# Altium schematic sheet main_9.SchDoc
size 212 x 108 mm; CNAME: RJ Cunningham
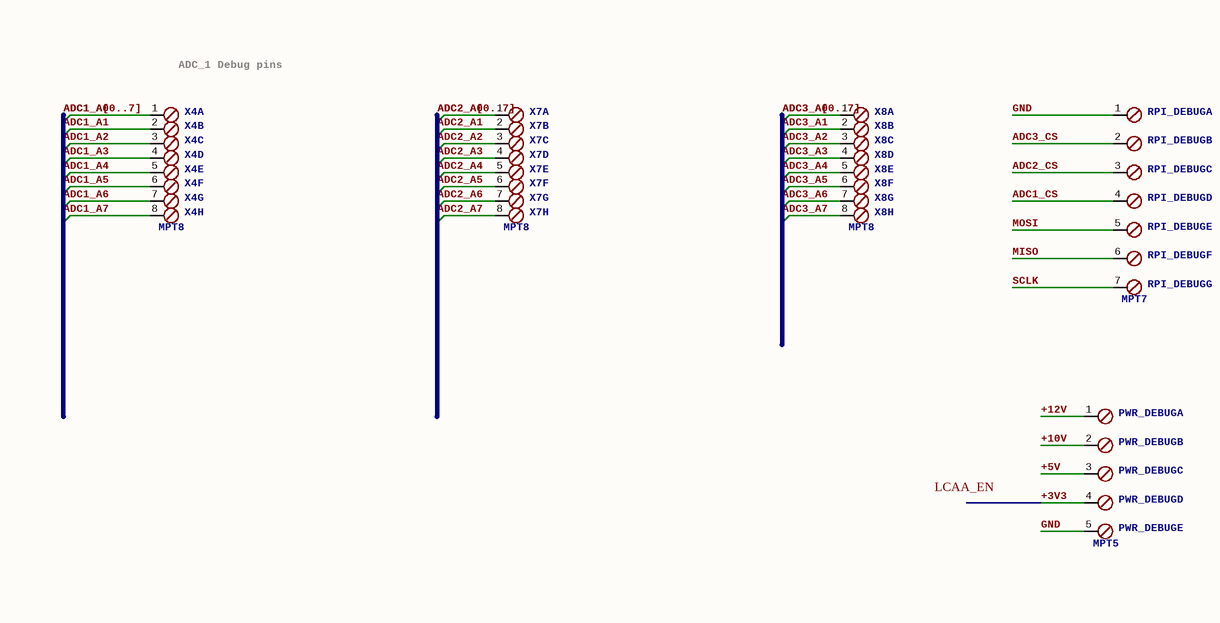
[diagram p0: main_9.SchDoc]

## Parts
PWR_DEBUG  MPT5  [5POL254]  (value not drawn)  (parts A,B,C,D,E of 5)
RPI_DEBUG  MPT7  [7POL254]  (value not drawn)  (parts A,B,C,D,E,F,G of 7)
X4  MPT8  [8POL254]  (value not drawn)  (parts A,B,C,D,E,F,G,H of 8)
X7  MPT8  [8POL254]  (value not drawn)  (parts A,B,C,D,E,F,G,H of 8)
X8  MPT8  [8POL254]  (value not drawn)  (parts A,B,C,D,E,F,G,H of 8)

## Nets
+3V3: PWR_DEBUG.4
+5V: PWR_DEBUG.3
+10V: PWR_DEBUG.2
+12V: PWR_DEBUG.1
ADC1_CS: RPI_DEBUG.4
ADC2_CS: RPI_DEBUG.3
ADC3_CS: RPI_DEBUG.2
GND: PWR_DEBUG.5 RPI_DEBUG.1
MISO: RPI_DEBUG.6
MOSI: RPI_DEBUG.5
SCLK: RPI_DEBUG.7

Not connected (* = marked no-connect by the designer): X4 1 2(1) 3(1) 4(1) 5(1) 6(1) 7(1) 8(1); X7 1 2(1) 3(1) 4(1) 5(1) 6(1) 7(1) 8(1); X8 1 2(1) 3(1) 4(1) 5(1) 6(1) 7(1) 8(1)

## Buses and harness runs
bus ADC1_A0 = ADC1_A1 = ADC1_A2 = ADC1_A3 = ADC1_A4 = ADC1_A5 = ADC1_A6 = ADC1_A7 = ADC1_A[0..7]
bus ADC2_A0 = ADC2_A1 = ADC2_A2 = ADC2_A3 = ADC2_A4 = ADC2_A5 = ADC2_A6 = ADC2_A7 = ADC2_A[0..7]
bus ADC3_A0 = ADC3_A1 = ADC3_A2 = ADC3_A3 = ADC3_A4 = ADC3_A5 = ADC3_A6 = ADC3_A7 = ADC3_A[0..7]

## Notes on the sheet
- (near X4) ADC_1 Debug pins
- Labels drawn without touching a wire or pin: LCAA_EN

## Library data of the parts
PWR_DEBUG = MPT5: PHOENIX CONNECTOR; GateName_1: -1; SymbolName_1: SKB; GateName_2: -2; GateName_3: -3; GateName_4: -4; GateName_5: -5; SymbolName_5: SKBV; SymbolName_2: SKB; SymbolName_3: SKB; SymbolName_4: SKB; LibraryName: con-phoenix-254; DeviceSetName: MPT5; MF: *; MPN: *; OC_FARNELL: unknown; OC_NEWARK: unknown
RPI_DEBUG = MPT7: PHOENIX CONNECTOR; GateName_1: -1; SymbolName_1: SKB; GateName_2: -2; GateName_3: -3; GateName_4: -4; GateName_5: -5; GateName_6: -6; GateName_7: -7; SymbolName_7: SKBV; SymbolName_2: SKB; SymbolName_3: SKB; SymbolName_4: SKB; SymbolName_5: SKB; SymbolName_6: SKB; LibraryName: con-phoenix-254; DeviceSetName: MPT7; MF: *; MPN: *; OC_FARNELL: unknown; OC_NEWARK: unknown
X4 X7 X8 = MPT8: PHOENIX CONNECTOR; GateName_1: -1; SymbolName_1: SKB; GateName_2: -2; GateName_3: -3; GateName_4: -4; GateName_5: -5; GateName_6: -6; GateName_7: -7; GateName_8: -8; SymbolName_8: SKBV; SymbolName_2: SKB; SymbolName_3: SKB; SymbolName_4: SKB; SymbolName_5: SKB; SymbolName_6: SKB; SymbolName_7: SKB; LibraryName: con-phoenix-254; DeviceSetName: MPT8; MF: *; MPN: *; OC_FARNELL: unknown; OC_NEWARK: unknown